# Altium schematic sheet booster12-70v.SchDoc
size A4; SheetNumber: 2; SheetTotal: 2
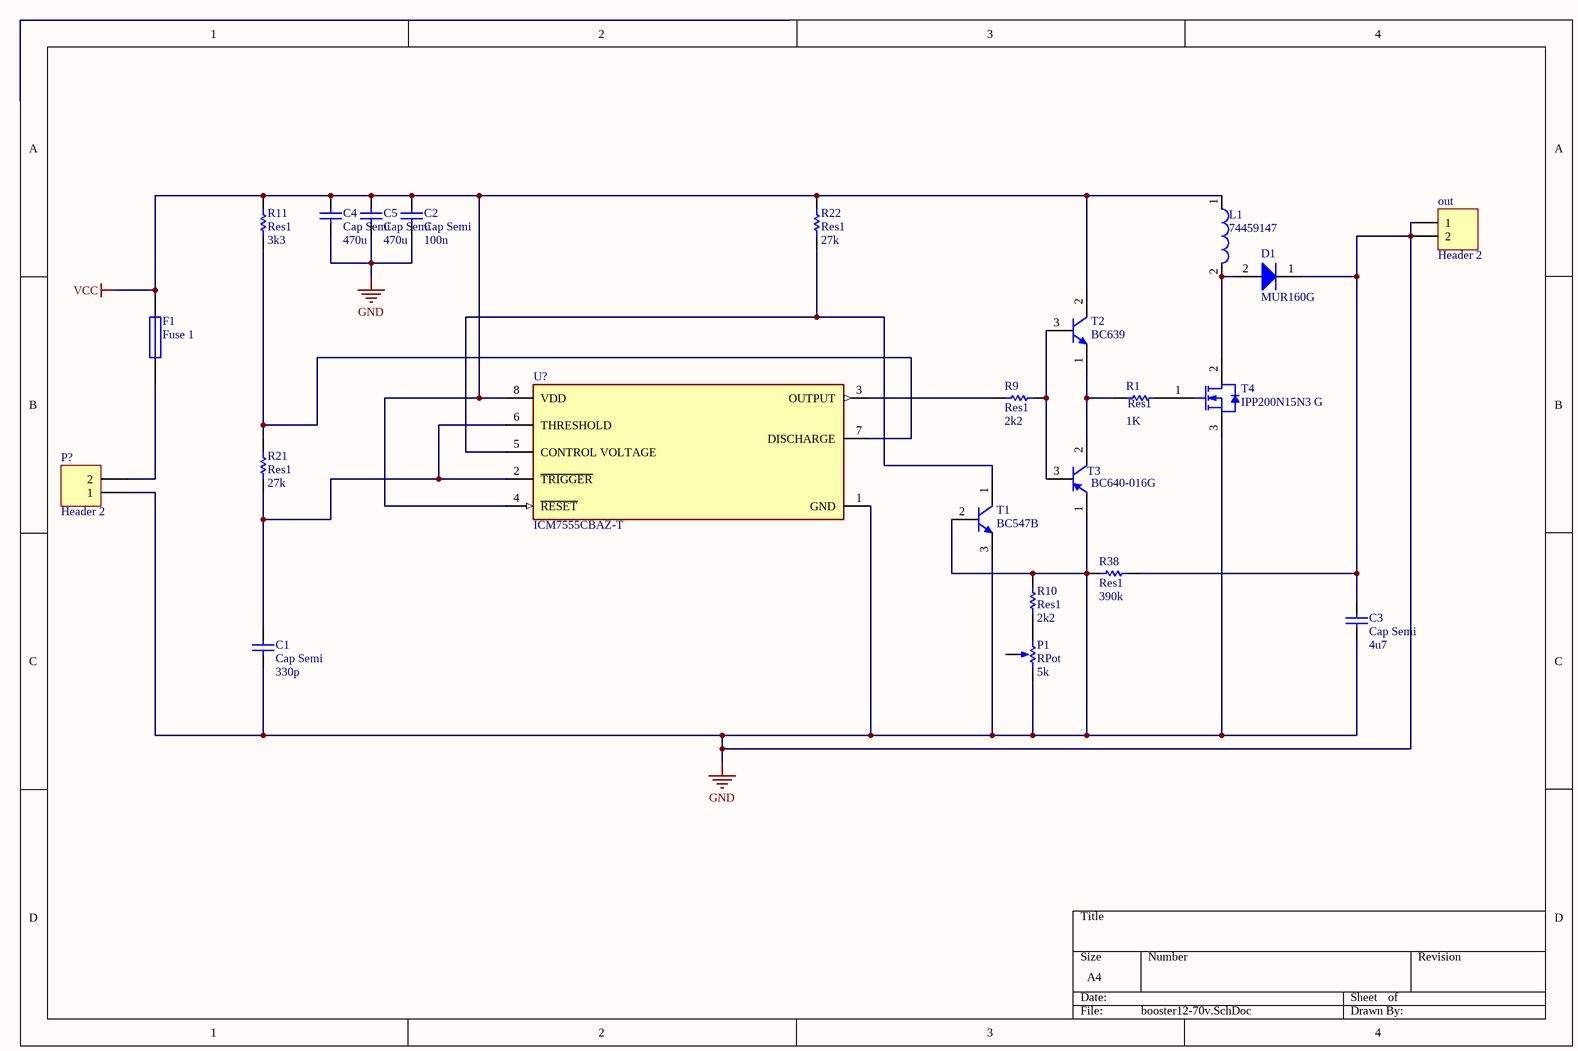
[diagram p0: booster12-70v.SchDoc]

## Parts
C1  Cap Semi  value 330p  [C1206]
C2  Cap Semi  value 100n  [C1206]
C3  Cap Semi  value 4u7  [C1206]
C4  Cap Semi  value 470u  [C1206]
C5  Cap Semi  value 470u  [C1206]
D1  MUR160G  [ONSC-AXIAL_LEAD-2-59-10_P]
F1  Fuse 1  [C1206]
L1  74459147  [WE-PD3-X]
out  Header 2  [HDR1X2]
P1  RPot  value 5k  [VR5]
P?  Header 2  [HDR1X2]
R1  Res1  value 1K  [C1206]
R9  Res1  value 2k2  [C1206]
R10  Res1  value 2k2  [C1206]
R11  Res1  value 3k3  [C1206]
R21  Res1  value 27k  [C1206]
R22  Res1  value 27k  [C1206]
R38  Res1  value 390k  [C1206]
T1  BC547B  [ONSC-TO-92-3-29-11]
T2  BC639  [ONSC-TO-92-3-29-11]
T3  BC640-016G  [ONSC-TO-92-3-29-11]
T4  IPP200N15N3 G  [INF-PG-TO220-3-1_A_V]
U?  ICM7555CBAZ-T  [FP-M8_15-IPC_B]

## Nets
GND: C1.1 C2.1 C3.1 C3.2 C4.1 C5.1 D1.1(K) out.1 out.2 P1.2(BOT) P?.1 R10.2 R38.1 R38.2 T1.2(B) T1.3(E) T3.1(E) T4.3(SOURCE) U?.1(GND)
VCC: C2.2 C4.2 C5.2 F1.2 L1.1 R11.2 R22.2 T2.2(C) U?.4(~{RESET}) U?.8(VDD)
NetC1_2: C1.2 R21.1 U?.2(~{TRIGGER}) U?.6(THRESHOLD)
NetD1_2: D1.2(A) L1.2 T4.2(DRAIN)
NetF1_1: F1.1 P?.2
NetP1_1: P1.1(TOP) R10.1
NetR1_1: R1.1 T2.1(E) T3.2(C)
NetR1_2: R1.2 T4.1(GATE)
NetR9_1: R9.1 U?.3(OUTPUT)
NetR9_2: R9.2 T2.3(B) T3.3(B)
NetR11_1: R11.1 R21.2 U?.7(DISCHARGE)
NetR22_1: R22.1 T1.1(C) U?.5(CONTROL_VOLTAGE)

Not connected (* = marked no-connect by the designer): P1 3(TAP)

## Library data of the parts
C1-C5 = Cap Semi: Capacitor (Semiconductor SIM Model); Published: 8-Jun-2000; LatestRevisionDate: 29-May-2009; LatestRevisionNote: IPC-7351 Footprint Added.; PackageReference: C1206; Publisher: Altium Limited; PackageDescription: Chip Capacitor
D1 = CMP-0902-00129-1: SWITCHMODE(TM) Power Rectifier, 2-Pin Axial_Lead, Pb-Free, Bulk Bag; Manufacturer: On Semiconductor; IFSM Max (A): 35; VRRM Max (V): 600; Type: Ultrafast; PackageVersion: Rev. U, 02/2005; PackageDescription: 2-Pin, Axial Lead, Diameter 2.35 mm; RoHS: TRUE; ComponentLink3Description: Package Specification; ComponentLink3URL: http://www.onsemi.cn/pub_link/Collateral/59-10.PDF; Packing: Bulk Bag; ComponentLink1URL: http://www.onsemi.com/; ComponentLink1Description: Manufacturer URL; ComponentLink2Description: Datasheet; ComponentLink2URL: http://www.onsemi.com/pub_link/Collateral/MUR120-D.PDF; PackageReference: AXIAL_LEAD-2-59-10; Mounting Technology: Through Hole; PartNumber: MUR160G; DatasheetVersion: Rev. 12
F1 = Fuse 1: Fuse; Published: 8-Jun-2000; LatestRevisionDate: 17-Jul-2002; LatestRevisionNote: Re-released for DXP Platform.; PackageReference: PIN-W2/E2.8; Publisher: Altium Limited; PackageDescription: Thru-Hole; 2 Leads
L1 = CMP-0227-00841-1: SMD Shielded Power Inductor WE-PD3, L = 47.0 µH; Inductance: 47.0 ÂµH; ComponentLink1Description: Manufacturer Link; PackageDescription: SMD Inductor, 2-Leads, Body 18.54 x 15.24 mm; ComponentLink1URL: http://www.we-online.com; ComponentLink2URL: http://www.we-online.de/katalog/media/pdf/74459147.pdf; PackageVersion: 2004; PackageReference: WE-PD3-X; DatasheetVersion: ver 1, Oct-2004; ComponentLink2Description: Datasheet
out P? = Header 2: Header, 2-Pin; LatestRevisionDate: 17-Jul-2002; LatestRevisionNote: Re-released for DXP Platform.; Publisher: Altium Limited
P1 = RPot: Potentiometer; Sim Note: Enter the Resistance value and the set point into parameter fields.; Set Position: 0.5; Published: 8-Jun-2000; LatestRevisionDate: 17-Jul-2002; LatestRevisionNote: Re-released for DXP Platform.; PackageReference: VR5; Publisher: Altium Limited; PackageDescription: Variable Resistor, Thru-Hole; 3 Leads
R1 R9-R11 R21 R22 R38 = Res1: Resistor; Published: 8-Jun-2000; LatestRevisionDate: 17-Jul-2002; LatestRevisionNote: Re-released for DXP Platform.; PackageReference: AXIAL-0.3; Publisher: Altium Limited; PackageDescription: Axial Device, Thru-Hole; 2 Leads; 0.3 in Pin Spacing
T1 = CMP-1048-01467-1: Amplifier Transistor, NPN Silicon, 3-Pin TO-92, Bulk Box; Manufacturer: On Semiconductor; IC Continuous (A): 0.1; fT Min (MHz): 150; DatasheetVersion: Rev. 7; ComponentLink1URL: http://www.onsemi.com/; Polarity: NPN; RoHS: FALSE; ComponentLink1Description: Manufacturer URL; Packing: Bulk Box; PackageDescription: 3-Pin Transistor Outline, Body 4.825 x 3.685 mm, Pitch 1.27 mm; ComponentLink3URL: http://www.onsemi.cn/pub_link/Collateral/2N6426-D.PDF; ComponentLink2Description: Datasheet; PackageVersion: Rev. AM; PackageReference: TO-92-3-29-11_AM_SL; ComponentLink3Description: Package Specification; Mounting Technology: Through Hole; PartNumber: BC547B; ComponentLink2URL: http://www.onsemi.com/pub_link/Collateral/BC546-D.PDF
T2 = CMP-1048-01471-1: High Current Transistor, NPN Silicon, 3-Pin TO-92, Bulk Box; Manufacturer: On Semiconductor; IC Continuous (A): 1; ComponentLink1URL: http://www.onsemi.com/; ComponentLink3Description: Package Specification; ComponentLink2URL: http://www.onsemi.com/pub_link/Collateral/BC635-D.PDF; RoHS: FALSE; ComponentLink3URL: http://www.onsemi.cn/pub_link/Collateral/2N6426-D.PDF; DatasheetVersion: Rev. 1; Packing: Bulk Box; ComponentLink2Description: Datasheet; Mounting Technology: Through Hole; PartNumber: BC639; PackageDescription: 3-Pin Transistor Outline, Body 4.825 x 3.685 mm, Pitch 1.27 mm; ComponentLink1Description: Manufacturer URL; PackageVersion: Rev. AM; Polarity: NPN; PackageReference: TO-92-3-29-11_AM_SL
T3 = CMP-1048-01475-1: High Current Transistor, PNP Silicon, 3-Pin TO-92, Pb-Free, Bulk Box; Manufacturer: On Semiconductor; IC Continuous (A): -0.5; PartNumber: BC640-016G; ComponentLink1Description: Manufacturer URL; ComponentLink2URL: http://www.onsemi.com/pub_link/Collateral/BC640-D.PDF; PackageVersion: Rev. AM; ComponentLink3URL: http://www.onsemi.cn/pub_link/Collateral/2N6426-D.PDF; Packing: Bulk Box; PackageDescription: 3-Pin Transistor Outline, Body 4.825 x 3.685 mm, Pitch 1.27 mm; Mounting Technology: Through Hole; PackageReference: TO-92-3-29-11_AM_SL; Polarity: PNP; RoHS: TRUE; ComponentLink2Description: Datasheet; ComponentLink3Description: Package Specification; DatasheetVersion: Rev. 1; ComponentLink1URL: http://www.onsemi.com/
T4 = CMP-1091-00080-1: N-Channel OptiMOS 3 Power-Transistor, 150 V VDS, 50 A ID, -55 to 175 degC, PG-TO220-3-1, Tube, Green; Manufacturer: Infineon; Rth: 1Â K/W; IDpuls (max): 200Â A; ID (max): 50Â A; VDS (max): 150Â V; VGS(th) (max): 4Â V; VGS(th) (min): 2Â V; RthJA (max): 75 K/W; Ptot (max): 150Â W; Green: TRUE; RDS (on) (max): 20Â mOhm; QG: 23Â nC; Polarity: N; ComponentLink1URL: http://www.infineon.com/; PackageVersion: Rev. 05, 08/2007; ComponentLink3URL: http://www.infineon.com/dgdl/IPP028N08N3_Rev1%5B1%5D.0.pdf?folderId=db3a304313b8b5a60113cee8763b02d7&fileId=db3a30432313ff5e0123a3c08e7326b5; RthJC (max): 1Â K/W; ComponentLink2Description: Datasheet; ComponentLink3Description: Package Specification; Halogen-free: TRUE; Mounting Technology: Through Hole; PartNumber: IPP200N15N3 G; PackageDescription: 3-Pin Plastic (Green) Transistor Single Outline Package, 10.03 x 8.98 mm Body, 2.54 mm Pitch; DatasheetVersion: Rev. 2.05; ComponentLink2URL: http://www.infineon.com/dgdl/IPD200N15N3_Rev25.pdf?folderId=db3a304313b8b5a60113cee8763b02d7&fileId=db3a30432313ff5e01239a0457643bbc; Packing: Tube; ComponentLink1Description: Manufacturer URL; PackageReference: PG-TO220-3-1
U? = CMP-13501-000001-1: IC OSC SINGLE TIMER 1MHZ 8-SOIC